# Altium schematic sheet USB_Interfaces.SchDoc
size A4; SheetNumber: 7; SheetTotal: 6
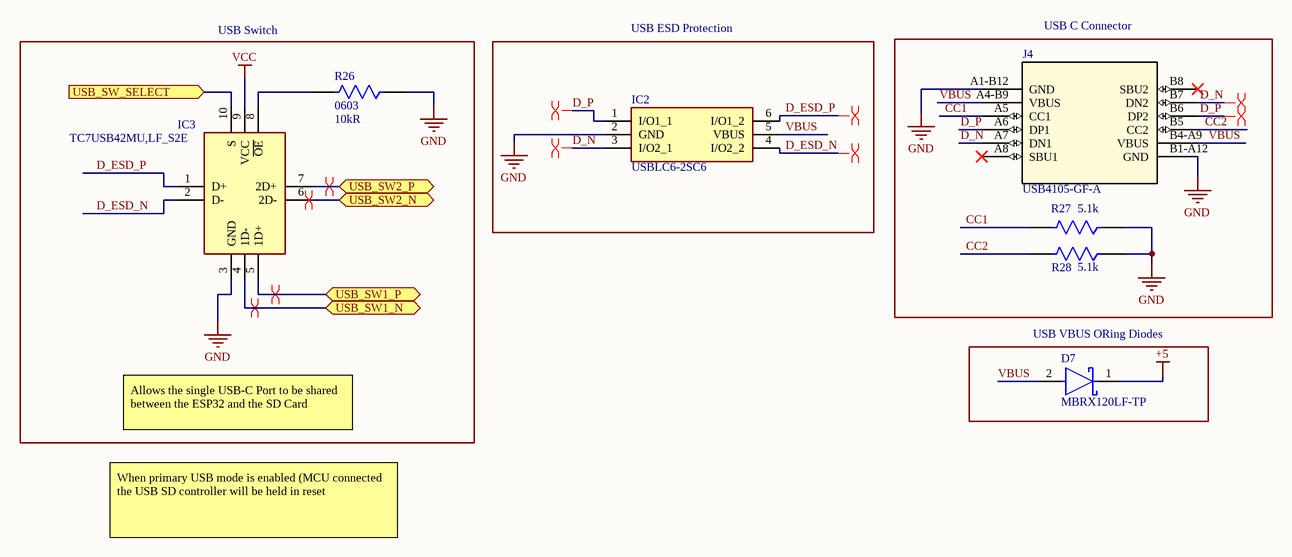
[diagram p0: USB_Interfaces.SchDoc]

## Parts
D7  MBRX120LF-TP  [FP-SOD-123-IPC_A]
IC2  USBLC6-2SC6  [SOT95P280X145-6N]
IC3  TC7USB42MU,LF_S2E  [TC7USB42MULFS2E]
J4  USB4105-GF-A  [USB4105_GCT]
R26  Case Code (Imperial): 0603  Resistance: 10kR  [FP-RMCF0603-MFG]  (hidden comment: RMCF0603JG10K0)
R27  Resistor: 5.1k  [FP-AC0603-MFG]  (hidden comment: AC0603FR-135K1L)
R28  Resistor: 5.1k  [FP-AC0603-MFG]  (hidden comment: AC0603FR-135K1L)

## Blocks framed on the sheet
USB Switch: IC3 R26
USB ESD Protection: IC2
USB C Connector: J4 R27 R28
USB VBUS ORing Diodes: D7

## Ports
USB_SW1_N (bidir), USB_SW1_P (bidir), USB_SW2_N (bidir), USB_SW2_P (bidir), USB_SW_SELECT (in)

## Nets
+5: D7.1(C)
GND: IC2.2(GND) IC3.3(GND) J4.A1-B12(GND) J4.B1-A12(GND) R26.1 R27.1 R28.1
VCC: IC3.9(VCC)
CC1: J4.A5(CC1) R27.2
CC2: J4.B5(CC2) R28.2
D_ESD_N: IC2.4(I/O2_2) IC3.2(D-)
D_ESD_P: IC2.6(I/O1_2) IC3.1(D+)
D_N: IC2.3(I/O2_1) J4.A7(DN1) J4.B7(DN2)
D_P: IC2.1(I/O1_1) J4.A6(DP1) J4.B6(DP2)
USB_SW1_N: IC3.4(1D-) ; port USB_SW1_N
USB_SW1_P: IC3.5(1D+) ; port USB_SW1_P
USB_SW2_N: IC3.6(2D-) ; port USB_SW2_N
USB_SW2_P: IC3.7(2D+) ; port USB_SW2_P
USB_SW_SELECT: IC3.10(S) ; port USB_SW_SELECT
VBUS: D7.2(A) IC2.5(VBUS) J4.A4-B9(VBUS) J4.B4-A9(VBUS)
NetIC3_8: IC3.8(~{OE}) R26.2

Not connected (* = marked no-connect by the designer): J4 A8(SBU1)* B8(SBU2)*

## Layout directives
differential pair: D_ESD_N, D_ESD_P, D_N, D_P, USB_SW1_N, USB_SW1_P, USB_SW2_N, USB_SW2_P

## Notes on the sheet
- Allows the single USB-C Port to be shared between the ESP32 and the SD Card
- When primary USB mode is enabled (MCU connected the USB SD controller will be held in reset

## Library data of the parts
D7 = CMP-56206-000012-1: DIODE SCHOTTKY 20V 1A SOD123; Max Power Dissipation: 556mW; Forward Voltage: 360mV; Peak Non-Repetitive Surge Current: 12A; Element Configuration: Single; Max Reverse Voltage (DC): 20V; Lead Free: Lead Free; Max Operating Temperature: 125°C; Radiation Hardening: No; Mount: Surface Mount; Number of Pins: 2; Average Rectified Current: 1A; Min Operating Temperature: -65°C; Max Repetitive Reverse Voltage (Vrrm): 20V; RoHS Compliant: Yes; Package Quantity: 1; Max Forward Surge Current (Ifsm): 12A; Packaging: Tape and Reel; Max Surge Current: 12A; Forward Current: 1A
IC2 = USBLC6-2SC6: Integrated Circuit; Manufacturer_Name: STMicroelectronics; Datasheet Link: http://www.st.com/st-web-ui/static/active/en/resource/technical/document/datasheet/CD00050750.pdf; Height: 1.45mm; Manufacturer_Part_Number: USBLC6-2SC6; Mouser Part Number: 511-USBLC6-2SC6; Mouser Price/Stock: https://www.mouser.co.uk/ProductDetail/STMicroelectronics/USBLC6-2SC6?qs=po45yt2pPpu%2FhNIlwQdTlg%3D%3D; Arrow Part Number: USBLC6-2SC6; Arrow Price/Stock: https://www.arrow.com/en/products/usblc6-2sc6/stmicroelectronics?region=nac
IC3 = TC7USB42MU,LF_S2E: Integrated Circuit; Manufacturer_Name: Toshiba; Manufacturer_Part_Number: TC7USB42MU,LF(S2E; Datasheet Link: https://toshiba.semicon-storage.com/ap-en/semiconductor/product/general-purpose-logic-ics/detail.TC7USB42MU.html; Height: 0.5mm; Mouser Part Number: 757-TC7USB42MULFS2E; Mouser Price/Stock: https://www.mouser.co.uk/ProductDetail/Toshiba/TC7USB42MULFS2E?qs=7D1LtPJG0i2u0rSmlbe57g%3D%3D
J4 = USB4105-GF-A: No Description Available; Mfr_Name: Global Connector Technology; Copyright: Copyright (C) 2022 Ultra Librarian. All rights reserved.; Manufacturer_Part_Number: USB4105-GF-A; Digi-Key_Part_Number_1: 2073-USB4105-GF-ACT-ND; Digi-Key_Part_Number_2: 2073-USB4105-GF-ADKR-ND; Digi-Key_Part_Number_3: 2073-USB4105-GF-ATR-ND; RefDes: RefDes; Type: DEV
R26 = CMP-26527-000153-1: 10kΩ ±5% 0.1W 0603 Thick Film Chip Resistor AEC-Q200 compliant; Temperature Coefficient: 200ppm/°C; Max Power Dissipation: 100mW; Tolerance: 5%; Series: RMCF; Resistor Type: Thick Film; Length: 0.061inch; Features: Automotive AEC-Q200; Height: 0.022inch; Case Code (Metric): 1608; Width: 0.031inch; Number of Terminations: 2; Contact Plating: Tin; Case/Package: 0603; Package Quantity: 1; Max Operating Temperature: 155°C; Mount: Surface Mount; RoHS Compliant: Yes; Radiation Hardening: No; Min Operating Temperature: -55°C; Packaging: Tape and Reel
R27 R28 = CMP-03412-003579-2: RES 5.1KΩ 1.00% 0.1W 0603; RoHS Compliant: Yes